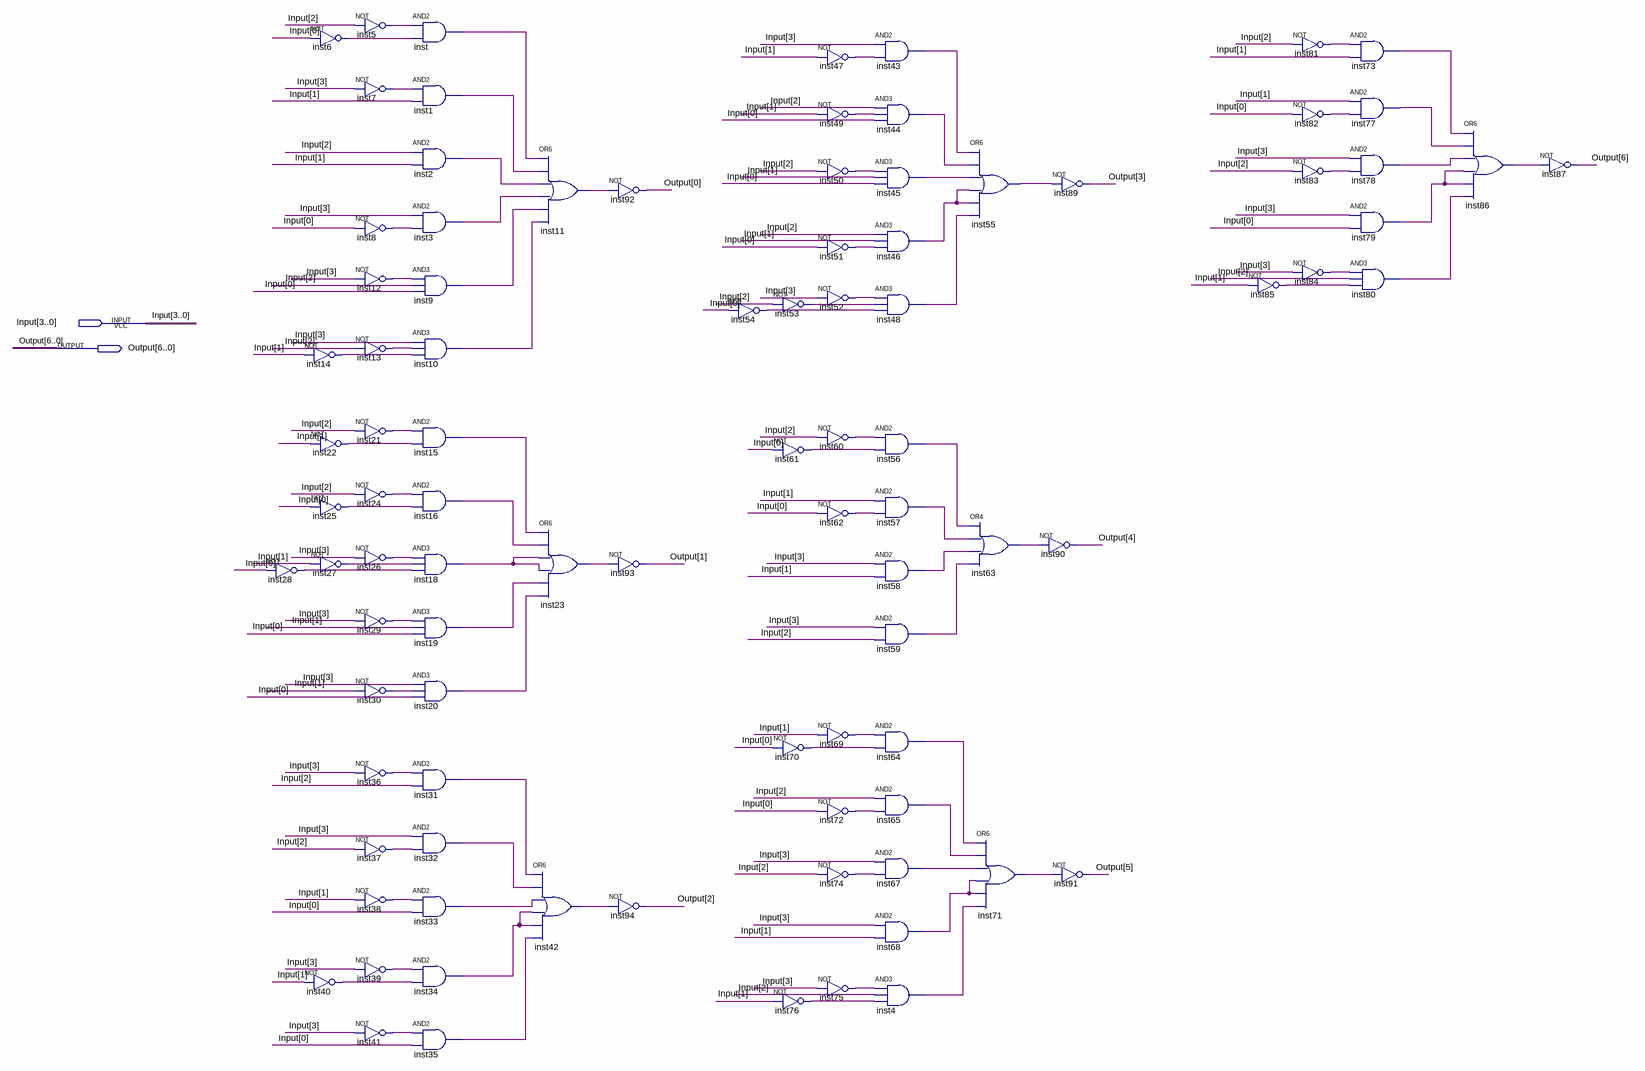
[diagram p0: schematic sheet]
// Quartus schematic Aula05.bdf as structural Verilog: 92 symbols, 2 pins
module Aula05 (
  input  [3:0] Input,
  output [6:0] Output
);

  wire inst1_out, inst2_out, inst3_out, inst4_out, inst5_out, inst6_out, inst7_out, inst8_out, inst9_out,
       inst10_out, inst11_out, inst12_out, inst13_out, inst14_out, inst15_out, inst16_out, inst18_out,
       inst19_out, inst20_out, inst21_out, inst22_out, inst23_out, inst24_out, inst25_out, inst26_out,
       inst27_out, inst28_out, inst29_out, inst30_out, inst31_out, inst32_out, inst33_out, inst34_out,
       inst35_out, inst36_out, inst37_out, inst38_out, inst39_out, inst40_out, inst41_out, inst42_out,
       inst43_out, inst44_out, inst45_out, inst46_out, inst47_out, inst48_out, inst49_out, inst50_out,
       inst51_out, inst52_out, inst53_out, inst54_out, inst55_out, inst56_out, inst57_out, inst58_out,
       inst59_out, inst60_out, inst61_out, inst62_out, inst63_out, inst64_out, inst65_out, inst67_out,
       inst68_out, inst69_out, inst70_out, inst71_out, inst72_out, inst73_out, inst74_out, inst75_out,
       inst76_out, inst77_out, inst78_out, inst79_out, inst80_out, inst81_out, inst82_out, inst83_out,
       inst84_out, inst85_out, inst86_out, inst_out;

  not inst28 (inst28_out, Input[0]);
  not inst6 (inst6_out, Input[0]);
  not inst14 (inst14_out, Input[1]);
  not inst22 (inst22_out, Input[1]);
  not inst25 (inst25_out, Input[0]);
  not inst27 (inst27_out, Input[1]);
  not inst40 (inst40_out, Input[1]);
  not inst5 (inst5_out, Input[2]);
  not inst7 (inst7_out, Input[3]);
  not inst8 (inst8_out, Input[0]);
  not inst12 (inst12_out, Input[3]);
  not inst13 (inst13_out, Input[2]);
  not inst21 (inst21_out, Input[2]);
  not inst24 (inst24_out, Input[2]);
  not inst26 (inst26_out, Input[3]);
  not inst29 (inst29_out, Input[3]);
  not inst30 (inst30_out, Input[1]);
  not inst36 (inst36_out, Input[3]);
  not inst37 (inst37_out, Input[2]);
  not inst38 (inst38_out, Input[1]);
  not inst39 (inst39_out, Input[3]);
  not inst41 (inst41_out, Input[3]);
  and inst (inst_out, inst5_out, inst6_out);
  and inst1 (inst1_out, inst7_out, Input[1]);
  and inst2 (inst2_out, Input[2], Input[1]);
  and inst3 (inst3_out, Input[3], inst8_out);
  and inst9 (inst9_out, inst12_out, Input[2], Input[0]);
  and inst10 (inst10_out, Input[3], inst13_out, inst14_out);
  and inst15 (inst15_out, inst21_out, inst22_out);
  and inst16 (inst16_out, inst24_out, inst25_out);
  and inst18 (inst18_out, inst26_out, inst27_out, inst28_out);
  and inst19 (inst19_out, inst29_out, Input[1], Input[0]);
  and inst20 (inst20_out, Input[3], inst30_out, Input[0]);
  and inst31 (inst31_out, inst36_out, Input[2]);
  and inst32 (inst32_out, Input[3], inst37_out);
  and inst33 (inst33_out, inst38_out, Input[0]);
  and inst34 (inst34_out, inst39_out, inst40_out);
  and inst35 (inst35_out, inst41_out, Input[0]);
  or inst11 (inst11_out, inst_out, inst1_out, inst2_out, inst3_out, inst9_out, inst10_out);
  or inst23 (inst23_out, inst15_out, inst16_out, inst18_out, inst18_out, inst19_out, inst20_out);
  or inst42 (inst42_out, inst31_out, inst32_out, inst33_out, inst34_out, inst34_out, inst35_out);
  not inst92 (Output[0], inst11_out);
  not inst93 (Output[1], inst23_out);
  not inst94 (Output[2], inst42_out);
  not inst54 (inst54_out, Input[0]);
  not inst53 (inst53_out, Input[2]);
  not inst61 (inst61_out, Input[0]);
  not inst70 (inst70_out, Input[0]);
  not inst76 (inst76_out, Input[1]);
  not inst47 (inst47_out, Input[1]);
  not inst49 (inst49_out, Input[1]);
  not inst50 (inst50_out, Input[2]);
  not inst51 (inst51_out, Input[0]);
  not inst52 (inst52_out, Input[3]);
  not inst60 (inst60_out, Input[2]);
  not inst62 (inst62_out, Input[0]);
  not inst69 (inst69_out, Input[1]);
  not inst72 (inst72_out, Input[0]);
  not inst74 (inst74_out, Input[2]);
  not inst75 (inst75_out, Input[3]);
  and inst43 (inst43_out, Input[3], inst47_out);
  and inst44 (inst44_out, Input[2], inst49_out, Input[0]);
  and inst45 (inst45_out, inst50_out, Input[1], Input[0]);
  and inst46 (inst46_out, Input[2], Input[1], inst51_out);
  and inst48 (inst48_out, inst52_out, inst53_out, inst54_out);
  and inst56 (inst56_out, inst60_out, inst61_out);
  and inst57 (inst57_out, Input[1], inst62_out);
  and inst58 (inst58_out, Input[3], Input[1]);
  and inst59 (inst59_out, Input[3], Input[2]);
  and inst64 (inst64_out, inst69_out, inst70_out);
  and inst65 (inst65_out, Input[2], inst72_out);
  and inst67 (inst67_out, Input[3], inst74_out);
  and inst68 (inst68_out, Input[3], Input[1]);
  and inst4 (inst4_out, inst75_out, Input[2], inst76_out);
  or inst55 (inst55_out, inst43_out, inst44_out, inst45_out, inst46_out, inst46_out, inst48_out);
  or inst63 (inst63_out, inst56_out, inst57_out, inst58_out, inst59_out);
  or inst71 (inst71_out, inst64_out, inst65_out, inst67_out, inst68_out, inst68_out, inst4_out);
  not inst89 (Output[3], inst55_out);
  not inst90 (Output[4], inst63_out);
  not inst91 (Output[5], inst71_out);
  not inst85 (inst85_out, Input[1]);
  not inst81 (inst81_out, Input[2]);
  not inst82 (inst82_out, Input[0]);
  not inst83 (inst83_out, Input[2]);
  not inst84 (inst84_out, Input[3]);
  and inst73 (inst73_out, inst81_out, Input[1]);
  and inst77 (inst77_out, Input[1], inst82_out);
  and inst78 (inst78_out, Input[3], inst83_out);
  and inst79 (inst79_out, Input[3], Input[0]);
  and inst80 (inst80_out, inst84_out, Input[2], inst85_out);
  or inst86 (inst86_out, inst73_out, inst77_out, inst78_out, inst79_out, inst79_out, inst80_out);
  not inst87 (Output[6], inst86_out);
endmodule
